# Altium schematic sheet USB.SchDoc: DaughterBoard Tester
size Letter; DrawnBy: MTAN; Organization: Altium Limited; DocumentNumber: 3; Revision: A; SheetNumber: 3; SheetTotal: 6
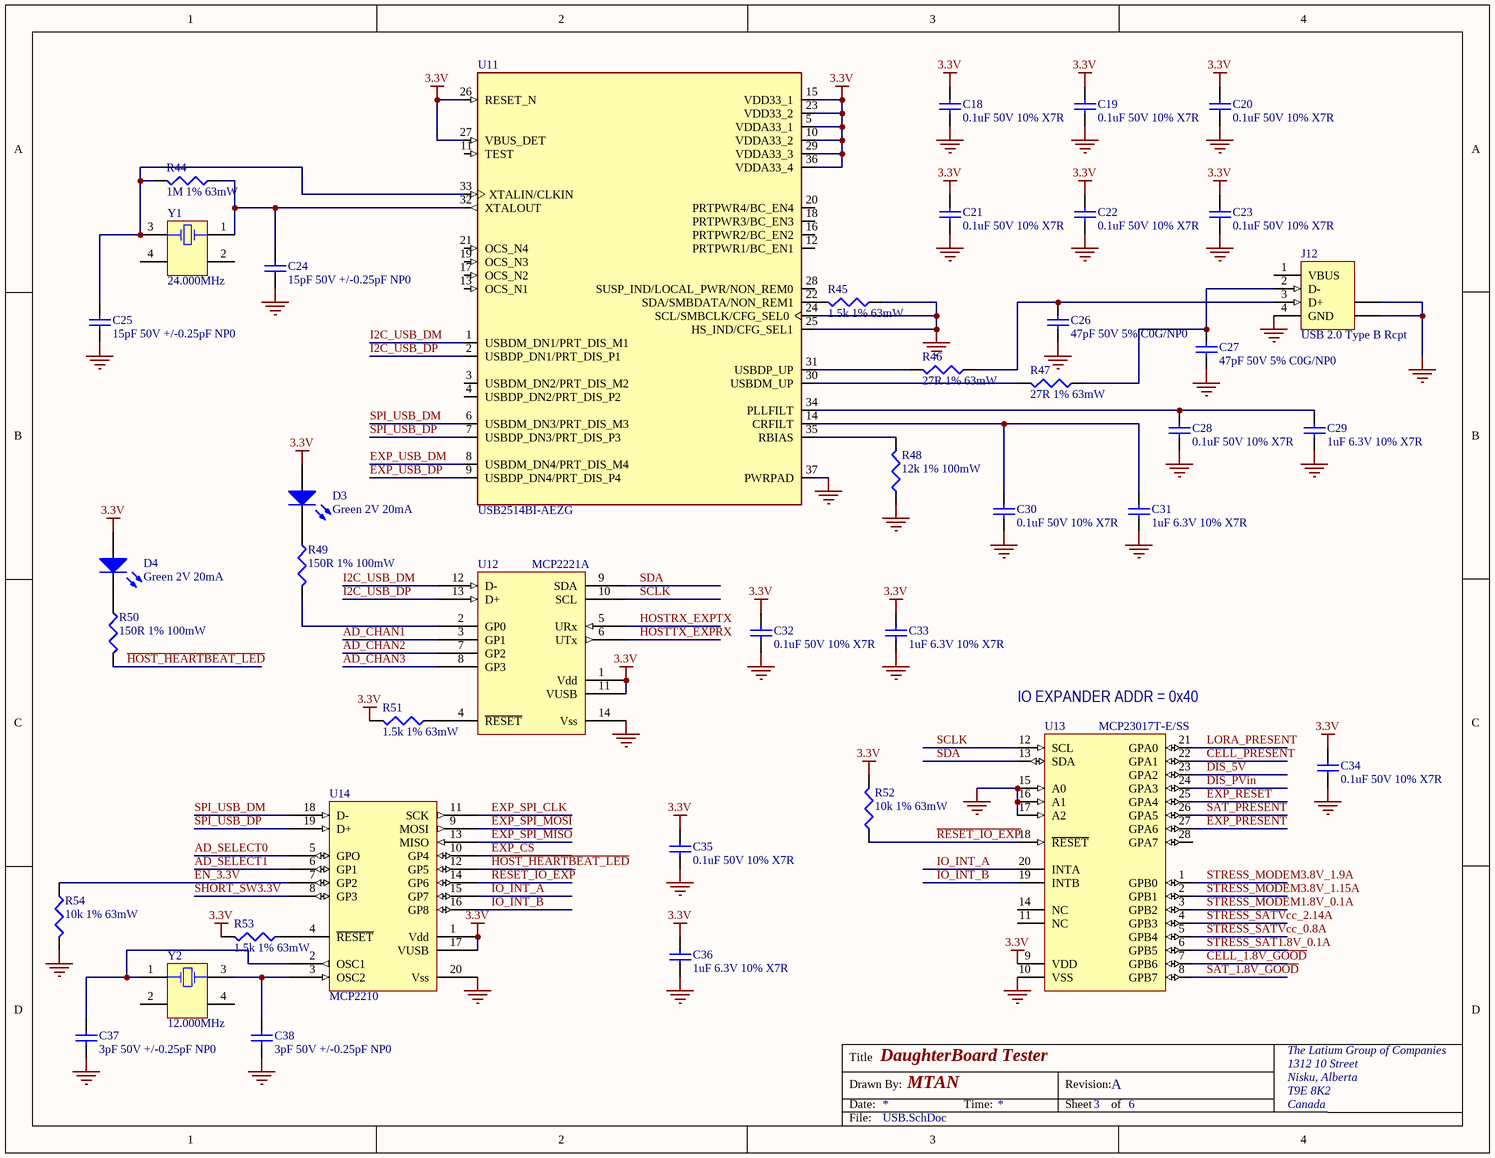
[diagram p0: USB.SchDoc]

## Parts
C18  0.1uF 50V 10% X7R  [CAPC1005L]
C19  0.1uF 50V 10% X7R  [CAPC1005L]
C20  0.1uF 50V 10% X7R  [CAPC1005L]
C21  0.1uF 50V 10% X7R  [CAPC1005L]
C22  0.1uF 50V 10% X7R  [CAPC1005L]
C23  0.1uF 50V 10% X7R  [CAPC1005L]
C24  15pF 50V +/-0.25pF NP0  [CAPC1005L]
C25  15pF 50V +/-0.25pF NP0  [CAPC1005L]
C26  47pF 50V 5% C0G/NP0  [CAPC1005L]
C27  47pF 50V 5% C0G/NP0  [CAPC1005L]
C28  0.1uF 50V 10% X7R  [CAPC1005L]
C29  1uF 6.3V 10% X7R  [CAPC1005L]
C30  0.1uF 50V 10% X7R  [CAPC1005L]
C31  1uF 6.3V 10% X7R  [CAPC1005L]
C32  0.1uF 50V 10% X7R  [CAPC1005L]
C33  1uF 6.3V 10% X7R  [CAPC1005L]
C34  0.1uF 50V 10% X7R  [CAPC1005L]
C35  0.1uF 50V 10% X7R  [CAPC1005L]
C36  1uF 6.3V 10% X7R  [CAPC1005L]
C37  3pF 50V +/-0.25pF NP0  [CAPC1005L]
C38  3pF 50V +/-0.25pF NP0  [CAPC1005L]
D3  Green 2V 20mA  [CD1608-0603]
D4  Green 2V 20mA  [CD1608-0603]
J12  USB 2.0 Type B Rcpt  [1-1734346-1]
R44  1M 1% 63mW  [RESC1005L]
R45  1.5k 1% 63mW  [RESC1005L]
R46  27R 1% 63mW  [RESC1005L]
R47  27R 1% 63mW  [RESC1005L]
R48  12k 1% 100mW  [J1-0603]
R49  150R 1% 100mW  [RESC1608L]
R50  150R 1% 100mW  [RESC1608L]
R51  1.5k 1% 63mW  [RESC1005L]
R52  10k 1% 63mW  [RESC1005L]
R53  1.5k 1% 63mW  [RESC1005L]
R54  10k 1% 63mW  [RESC1005L]
U11  USB2514BI-AEZG  [QFN50P600X600X100-37N]
U12  MCP2221A  [TSSOP14_L]
U13  MCP23017T-E/SS  [SSOP-SS28_L]
U14  MCP2210  [SSOP20_L]
Y1  24.000MHz  [CFPX-5]
Y2  12.000MHz  [CFPX-5]

## Nets
3.3V: C18.1 C19.1 C20.1 C21.1 C22.1 C23.1 C32.1 C33.1 C34.1 C35.1 C36.1 D3.1(A) D4.1(A) R51.2 R52.2 R53.2 U11.5(VDDA33_1) U11.10(VDDA33_2) U11.15(VDD33_1) U11.23(VDD33_2) U11.26(RESET_N) U11.27(VBUS_DET) U11.29(VDDA33_3) U11.36(VDDA33_4) U12.1(Vdd) U12.11(VUSB) U13.9(VDD) U14.1(Vdd) U14.17(VUSB)
GND: C18.2 C19.2 C20.2 C21.2 C22.2 C23.2 C24.2 C25.2 C26.2 C27.2 C28.2 C29.2 C30.2 C31.2 C32.2 C33.2 C34.2 C35.2 C36.2 C37.2 C38.2 J12.4(GND) J12.MP1(SHLD) J12.MP2(SHLD) R45.1 R48.1 R54.2 U11.24(SCL/SMBCLK/CFG_SEL0) U11.25(HS_IND/CFG_SEL1) U11.37(PWRPAD) U12.14(Vss) U13.10(VSS) U13.15(A0) U13.16(A1) U13.17(A2) U14.20(Vss)
AD_CHAN1: U12.3(GP1)
AD_CHAN2: U12.7(GP2)
AD_CHAN3: U12.8(GP3)
AD_SELECT0: U14.5(GPO)
AD_SELECT1: U14.6(GP1)
~{CELL_1.8V_GOOD}: U13.7(GPB6)
CELL_PRESENT: U13.22(GPA1)
DIS_5V: U13.23(GPA2)
DIS_PVin: U13.24(GPA3)
~{EXP_CS}: U14.10(GP4)
EN_3.3V: R54.1 U14.7(GP2)
EXP_PRESENT: U13.27(GPA6)
EXP_RESET: U13.25(GPA4)
EXP_SPI_CLK: U14.11(SCK)
EXP_SPI_MISO: U14.13(MISO)
EXP_SPI_MOSI: U14.9(MOSI)
EXP_USB_DM: U11.8(USBDM_DN4/PRT_DIS_M4)
EXP_USB_DP: U11.9(USBDP_DN4/PRT_DIS_P4)
~{HOST_HEARTBEAT_LED}: R50.2 U14.12(GP5)
HOSTRX_EXPTX: U12.5(URx)
HOSTTX_EXPRX: U12.6(UTx)
I2C_USB_DM: U11.1(USBDM_DN1/PRT_DIS_M1) U12.12(D-)
I2C_USB_DP: U11.2(USBDP_DN1/PRT_DIS_P1) U12.13(D+)
IO_INT_A: U13.20(INTA) U14.15(GP7)
IO_INT_B: U13.19(INTB) U14.16(GP8)
LORA_PRESENT: U13.21(GPA0)
~{RESET_IO_EXP}: R52.1 U13.18(~{RESET}) U14.14(GP6)
~{SAT_1.8V_GOOD}: U13.8(GPB7)
~{SHORT_SW3.3V}: U14.8(GP3)
SAT_PRESENT: U13.26(GPA5)
SCLK: U12.10(SCL) U13.12(SCL)
SDA: U12.9(SDA) U13.13(SDA)
SPI_USB_DM: U11.6(USBDM_DN3/PRT_DIS_M3) U14.18(D-)
SPI_USB_DP: U11.7(USBDP_DN3/PRT_DIS_P3) U14.19(D+)
STRESS_MODEM1.8V_0.1A: U13.3(GPB2)
STRESS_MODEM3.8V_1.9A: U13.1(GPB0)
STRESS_MODEM3.8V_1.15A: U13.2(GPB1)
STRESS_SAT1.8V_0.1A: U13.6(GPB5)
STRESS_SATVcc_0.8A: U13.5(GPB4)
STRESS_SATVcc_2.14A: U13.4(GPB3)
NetC24_1: C24.1 R44.1 U11.32(XTALOUT) Y1.1(OSC1)
NetC25_1: C25.1 R44.2 U11.33(XTALIN/CLKIN) Y1.3(OSC2)
NetC26_1: C26.1 J12.3(D+) R46.1
NetC27_1: C27.1 J12.2(D-) R47.1
NetC28_1: C28.1 C29.1 U11.34(PLLFILT)
NetC30_1: C30.1 C31.1 U11.14(CRFILT)
NetC37_1: C37.1 U14.2(OSC1) Y2.1(OSC1)
NetC38_1: C38.1 U14.3(OSC2) Y2.3(OSC2)
NetD3_2: D3.2(K) R49.1
NetD4_2: D4.2(K) R50.1
NetR45_2: R45.2 U11.22(SDA/SMBDATA/NON_REM1)
NetR46_2: R46.2 U11.31(USBDP_UP)
NetR47_2: R47.2 U11.30(USBDM_UP)
NetR48_2: R48.2 U11.35(RBIAS)
NetR49_2: R49.2 U12.2(GP0)
NetR51_1: R51.1 U12.4(~{RESET})
NetR53_1: R53.1 U14.4(~{RESET})

Not connected (* = marked no-connect by the designer): J12 1(VBUS); U11 3(USBDM_DN2/PRT_DIS_M2) 4(USBDP_DN2/PRT_DIS_P2) 11(TEST) 12(PRTPWR1/BC_EN1) 13(OCS_N1) 16(PRTPWR2/BC_EN2) 17(OCS_N2) 18(PRTPWR3/BC_EN3) 19(OCS_N3) 20(PRTPWR4/BC_EN4) 21(OCS_N4) 28(SUSP_IND/LOCAL_PWR/NON_REM0); U13 11(NC) 14(NC) 28(GPA7); Y1 2(NC) 4(NC); Y2 2(NC) 4(NC)

## Notes on the sheet
- (near U13) IO EXPANDER ADDR = 0x40
- Title
- Drawn By:
- Date:
- Time:
- Revision:
- Sheet
- of
- The Latium Group of Companies
- 1312 10 Street
- Nisku, Alberta
- T9E 8K2
- Canada
- File:

## Library data of the parts
C18-C38 = Cap: Capacitor
  C18-C23 C28 C30 C32 C34 C35: Value: 0.1uF 50V 10% X7R
  C24 C25: Value: 15pF 50V +/-0.25pF NP0
  C26 C27: Value: 47pF 50V 5% C0G/NP0
  C29 C31 C33 C36: Value: 1uF 6.3V 10% X7R
  C37 C38: Value: 3pF 50V +/-0.25pF NP0
D3 D4 = LED2: LED GREEN CLEAR 0603 SMD; Manufacturer: Wurth Electronics Inc; Manufacturer Part Number: 150060VS75000; Value: Green 2V 20mA; Supplier 1: Digi-Key; Supplier 1 Part Number: 732-4980-1-ND
J12 = 1-1470156-1: CONN RCPT USB2.0 TYPEB 4P SMD RA; Manufacturer: TE Connectivity AMP Connectors; Value: USB 2.0 Type B Rcpt; Manufacturer Part Number: 1-1734346-1; Supplier 1: Digi-Key; Supplier 1 Part Number: A110862CT-ND
R44-R54 = Res3: Resistor
  R44: Value: 1M 1% 63mW
  R45 R51 R53: Value: 1.5k 1% 63mW
  R46 R47: Value: 27R 1% 63mW
  R48: Value: 12k 1% 100mW
  R49 R50: Value: 150R 1% 100mW
  R52 R54: Value: 10k 1% 63mW
U11 = USB2514BI-AEZG: IC CONTROLLER USB 36QFN; Manufacturer: Microchip Technology; Value: USB2514BI-AEZG-TR; Manufacturer Part Number: USB2514BI-AEZG-TR; Supplier 1: Digi-Key; Supplier 1 Part Number: USB2514BI-AEZG-CT-ND
U12 = MCP2221A: IC USB TO I2C/UART 14TSSOP; Manufacturer: Microchip Technology; Manufacturer Part Number: MCP2221AT-I/ST; Value: MCP2221A; Supplier 1: Digi-Key; Supplier 1 Part Number: MCP2221AT-I/STCT-ND
U13 = MCP23017-E/SS: IC I/O EXPANDER 16BIT I2C 28SSOP; Manufacturer: Microchip Technology; Value: MCP23017T-E/SS; Manufacturer Part Number: MCP23017T-E/SS; Supplier 1: Digi-Key; Supplier 1 Part Number: MCP23017T-E/SSCT-ND
U14 = MCP2210: IC CONVERTER USB-SPI 20-SSOP; Manufacturer: Microchip Technology; Manufacturer Part Number: MCP2210T-I/SS; Value: MCP2210; Supplier 1: Digi-Key; Supplier 1 Part Number: MCP2210T-I/SSCT-ND
Y1 = CFPX-5: CRYSTAL 24.0000MHZ 18PF SMD; Manufacturer Part Number: TSX-3225 24.0000MF18X-C0; Manufacturer: Epson; Value: 24.000MHz; Supplier 1: Digi-Key; Supplier 1 Part Number: SER4210CT-ND
Y2 = CFPX-5: CRYSTAL 12.0000MHZ 8PF SMD; Manufacturer Part Number: NX3225SA-12.000M-STD-CRS-2; Manufacturer: NDK America Inc; ComponentLink1Description: Data Sheet; ComponentLink1URL: S:\Hardware\Data Sheets\Passive\Crystals\c_NX3225SA-STD-CRS-2_e.pdf; Value: 12.000MHz; Supplier 1: Digi-Key; Supplier 1 Part Number: 644-1128-1-ND